# EAGLE design v1 (EAGLE 7.6.0)
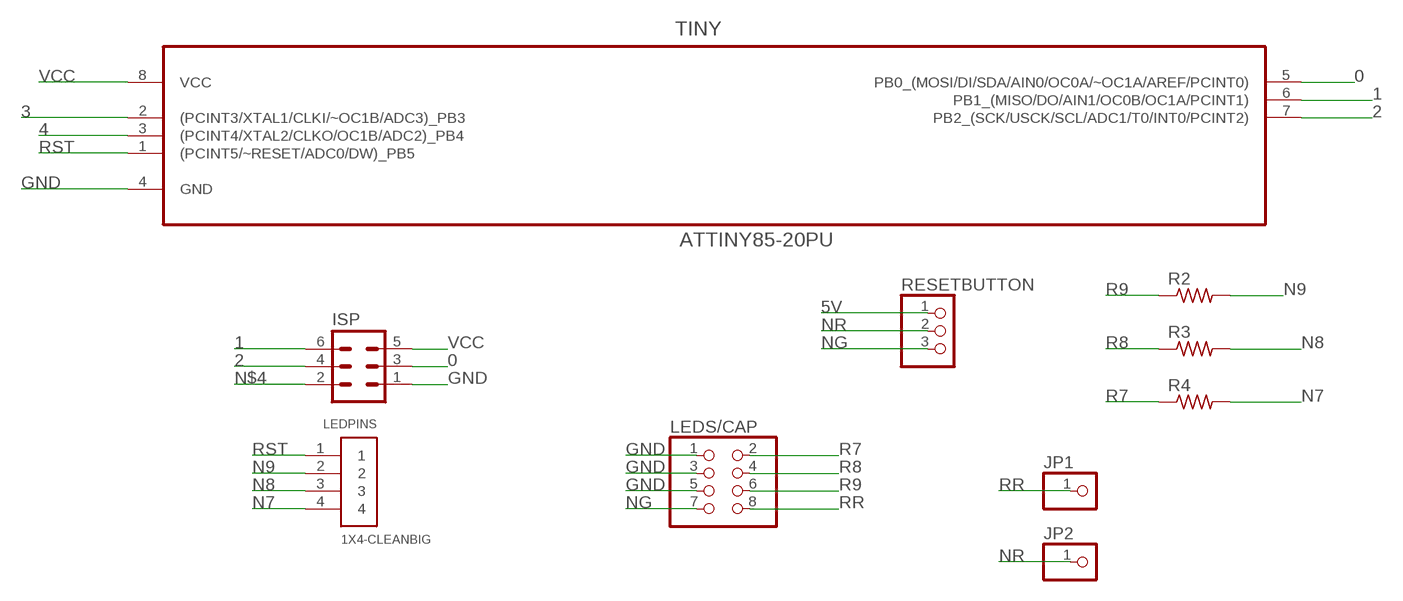
[diagram p0: schematic, sheet 1]

## Parts
ISP  MA03-2  [MA03-2]
JP1  PINHD-1X1CB  [1X01-CLEANBIG]
JP2  PINHD-1X1CB  [1X01-CLEANBIG]
LEDPINS  1X4-CLEANBIG  [1X04-CLEANBIG]
LEDS/CAP  PINHD-2X4  [2X04]
R2  R-US_0204/7  [0204/7]
R3  R-US_0204/7  [0204/7]
R4  R-US_0204/7  [0204/7]
RESETBUTTON  PINHD-1X3CB  [1X03-CLEANBIG]
TINY  ATTINY85-20PU  [DIP254P762X533-8]

## Nets
0: ISP.3 TINY.5(PB0_(MOSI/DI/SDA/AIN0/OC0A/~OC1A/AREF/PCINT0))
1: ISP.6 TINY.6(PB1_(MISO/DO/AIN1/OC0B/OC1A/PCINT1))
2: ISP.4 TINY.7(PB2_(SCK/USCK/SCL/ADC1/T0/INT0/PCINT2))
3: TINY.2((PCINT3/XTAL1/CLKI/~OC1B/ADC3)_PB3)
4: TINY.3((PCINT4/XTAL2/CLKO/OC1B/ADC2)_PB4)
5V: RESETBUTTON.1
GND: ISP.1 LEDS/CAP.1 LEDS/CAP.3 LEDS/CAP.5 TINY.4(GND)
N7: LEDPINS.4 R4.2
N8: LEDPINS.3 R3.2
N9: LEDPINS.2 R2.2
N$4: ISP.2
NG: LEDS/CAP.7 RESETBUTTON.3
NR: JP2.1 RESETBUTTON.2
R7: LEDS/CAP.2 R4.1
R8: LEDS/CAP.4 R3.1
R9: LEDS/CAP.6 R2.1
RR: JP1.1 LEDS/CAP.8
RST: LEDPINS.1 TINY.1((PCINT5/~RESET/ADC0/DW)_PB5)
VCC: ISP.5 TINY.8(VCC)

## Library data of the parts
ISP = con-lstb:MA03-2: PIN HEADER; OC_FARNELL: unknown; OC_NEWARK: unknown
JP1 JP2 = adafruit:PINHD-1X1: Pin header 1x1 for 0.1" spacing With round pins
LEDPINS = adafruit:1X4: 4-pin connector
LEDS/CAP = adafruit:PINHD-2X4: PIN HEADER
R2-R4 = resistor:R-US_: RESISTOR, American symbol
RESETBUTTON = adafruit:PINHD-1X3: PIN HEADER
TINY = Atmel_By_element14_Batch_1-00:ATTINY85-20PU: 8-bit Microcontroller with In-System Programmable Flash; MPN: ATTINY85-20PU; OC_FARNELL: 1455162; OC_NEWARK: 58M3796; PACKAGE: PDIP-8; SUPPLIER: Atmel

## Board
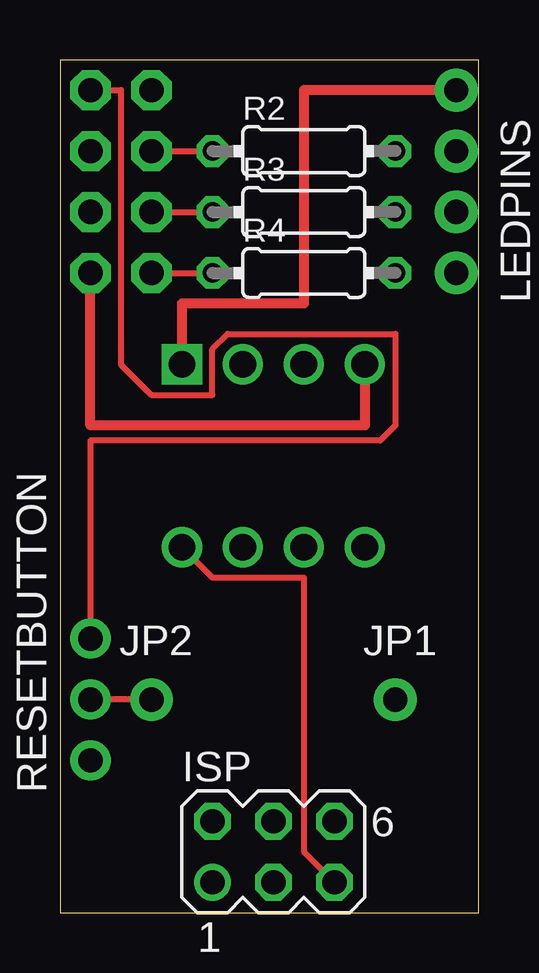
[diagram p1: board, top side]
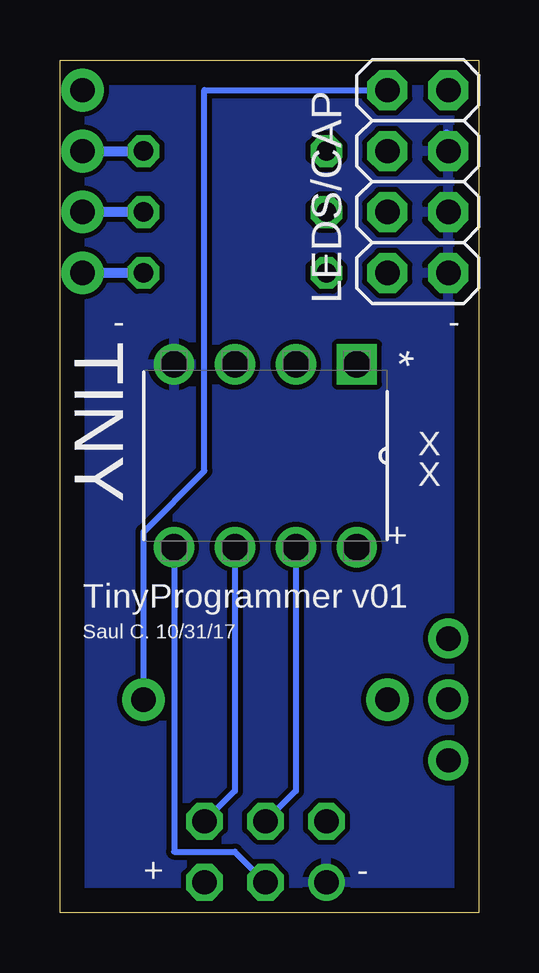
[diagram p2: board, bottom side, seen from below]

Size 17.45 x 35.55 mm. Coordinates in mm from the lower left corner, seen from the top.
Outline: 0,0 17.45,0 17.45,35.55 0,35.55 0,0
Copper layers (1*16): Top 0.035mm / dielectric 1.5mm / Bottom 0.035mm
Design rules "default": minimum track width 10mil, minimum drill 24mil, track to track 8mil, track to pad 8mil, pad to pad 8mil, via to via 8mil, smd to smd 8mil, copper to edge 40mil, drill to drill 8mil, minimum pad ring 10mil, minimum via ring 8mil, stop-mask expansion 4mil, vias tented up to drill 0mil, thermal gap 10mil

### Footprints (pad centres in the part's own frame; a part is rotated, then mirrored left to right if it is on the bottom)
MA03-2 = drill 1.016: 1 -2.54,-1.27 | drill 1.016 octagon: 2 -2.54,1.27; 3 0,-1.27; 4 0,1.27; 5 2.54,-1.27; 6 2.54,1.27
1X01-CLEANBIG = drill 1.016 pad 1.778: 1 0,0
1X04-CLEANBIG = drill 1.016 pad 1.778: 1 -3.81,0; 2 -1.27,0; 3 1.27,0; 4 3.81,0
2X04 = drill 1.016 pad 1.676 octagon: 1 -3.81,-1.27; 2 -3.81,1.27; 3 -1.27,-1.27; 4 -1.27,1.27; 5 1.27,-1.27; 6 1.27,1.27; 7 3.81,-1.27; 8 3.81,1.27
0204/7 = drill 0.813 octagon: 1 -3.81,0; 2 3.81,0
1X03-CLEANBIG = drill 1.016 pad 1.676: 1 -2.54,0; 2 0,0; 3 2.54,0
DIP254P762X533-8 = drill 1.118 square: 1 -7.62,7.62 | drill 1.118: 2 -7.62,5.08; 3 -7.62,2.54; 4 -7.62,0; 5 0,0; 6 0,2.54; 7 0,5.08; 8 0,7.62

### Placement (x,y rotation side)
ISP  8.89,2.54 0 top
JP1  13.97,8.89 0 top
JP2  3.81,8.89 0 top
LEDPINS  16.51,30.48 270 top
LEDS/CAP  2.54,30.48 90 bottom
R2  10.16,31.75 0 top
R3  10.16,29.21 0 top
R4  10.16,26.67 0 top
RESETBUTTON  1.27,8.89 90 top
TINY  12.7,15.24 270 bottom

### Tracks (layer width: path | path; a pad name or v marks a point on that pad's centre or on a via)
0
  Bottom 0.254: ISP.3 10.16,2.54 12.7,2.54 TINY.5
1
  Bottom 0.254: ISP.6 10.16,5.08 TINY.6
2
  Bottom 0.254: ISP.4 7.62,5.08 TINY.7
GND
  Top 0.406: TINY.4 12.7,20.32 1.27,20.32 LEDS/CAP.1
  Bottom 0.254: 1.32,32.54 1.37,32.54 LEDS/CAP.5
  pour Bottom: 0,0 0,35.56 17.78,35.56 17.78,0
N7
  Bottom 0.406: R4.2 LEDPINS.4
N8
  Bottom 0.406: R3.2 LEDPINS.3
N9
  Bottom 0.406: LEDPINS.2 R2.2
NG
  Top 0.254: RESETBUTTON.3 1.27,19.68 13.34,19.68 13.97,20.32 13.97,24.13 6.99,24.13 6.35,23.49 6.35,21.59 3.81,21.59 2.54,22.86 2.54,34.29 LEDS/CAP.7
NR
  Top 0.254: JP2.1 RESETBUTTON.2
R7
  Top 0.254: LEDS/CAP.2 R4.1
R8
  Top 0.254: LEDS/CAP.4 R3.1
R9
  Top 0.254: LEDS/CAP.6 R2.1
RR
  Bottom 0.254: LEDS/CAP.8 11.43,34.29 11.43,18.41 13.97,15.88 JP1.1
RST
  Top 0.406: LEDPINS.1 10.16,34.29 10.16,25.4 5.08,25.4 TINY.1
VCC
  Top 0.254: ISP.5 10.16,2.54 10.16,13.97 6.35,13.97 TINY.8

### Text on the board
bPlace: - | - | X | X | + | TinyProgrammer v01 | Saul C. 10/31/17 | - | +